# Altium schematic sheet 晶振.SchDoc
size A4
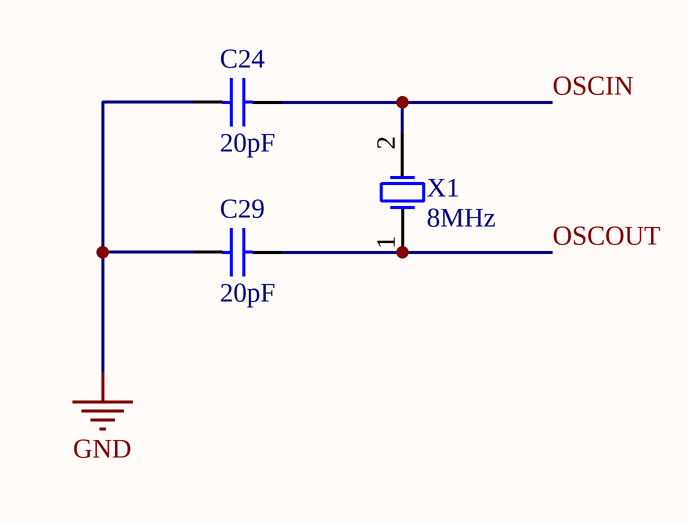
[diagram p0: 晶振.SchDoc]

## Parts
C24  20pF  [LC-0805_C]
C29  20pF  [LC-0805_C]
X1  8MHz  [XTAL_US]

## Nets
GND: C24.1 C29.1
OSCIN: C24.2 X1.2(OSC2)
OSCOUT: C29.2 X1.1(OSC1)

## Library data of the parts
C24 C29 = Cap: 100nF��0805��50V,+/-10%
X1 = XTAL: 8MHz����49S